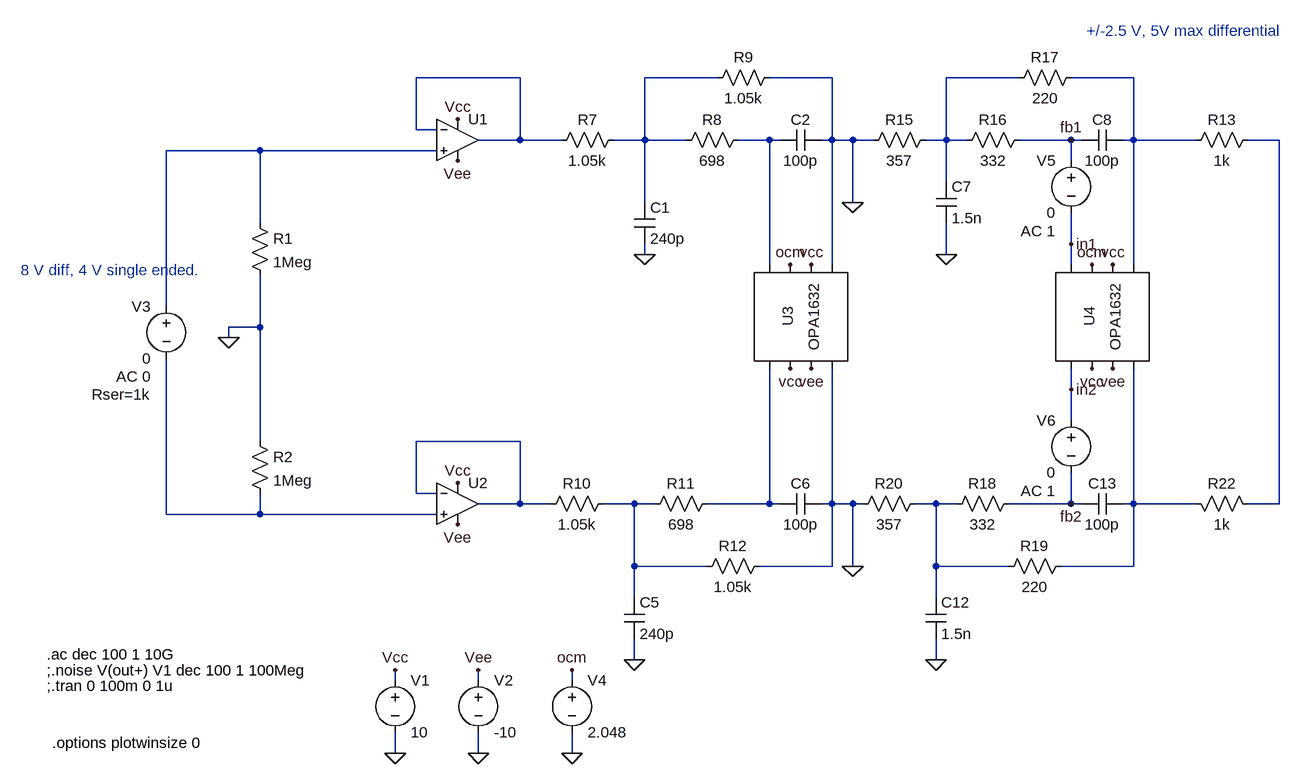
[diagram p0: schematic analog frontend stability.asc]
analog frontend stability.asc, the LTspice schematic file:
Version 4
SHEET 1 3264 948
WIRE 448 -112 288 -112
WIRE 752 -112 640 -112
WIRE 928 -112 832 -112
WIRE 1216 -112 1104 -112
WIRE 1392 -112 1296 -112
WIRE 288 -32 288 -112
WIRE 320 -32 288 -32
WIRE 448 -16 448 -112
WIRE 448 -16 384 -16
WIRE 512 -16 448 -16
WIRE 640 -16 640 -112
WIRE 640 -16 592 -16
WIRE 704 -16 640 -16
WIRE 832 -16 784 -16
WIRE 848 -16 832 -16
WIRE 928 -16 928 -112
WIRE 928 -16 912 -16
WIRE 960 -16 928 -16
WIRE 992 -16 960 -16
WIRE 1104 -16 1104 -112
WIRE 1104 -16 1072 -16
WIRE 1136 -16 1104 -16
WIRE 1296 -16 1216 -16
WIRE 1312 -16 1296 -16
WIRE 1392 -16 1392 -112
WIRE 1392 -16 1376 -16
WIRE 1488 -16 1392 -16
WIRE 1616 -16 1568 -16
WIRE 48 0 -96 0
WIRE 320 0 48 0
WIRE 1296 16 1296 -16
WIRE 1104 48 1104 -16
WIRE 640 80 640 -16
WIRE 960 80 960 -16
WIRE 48 112 48 0
WIRE 1296 144 1296 96
WIRE 640 160 640 144
WIRE 1104 160 1104 112
WIRE 832 176 832 -16
WIRE 928 176 928 -16
WIRE 1296 176 1296 144
WIRE 1392 176 1392 -16
WIRE -96 240 -96 0
WIRE 48 272 48 192
WIRE 48 272 0 272
WIRE 0 288 0 272
WIRE 1296 368 1296 336
WIRE 1296 416 1296 368
WIRE 48 448 48 272
WIRE 448 448 288 448
WIRE 288 528 288 448
WIRE 320 528 288 528
WIRE 448 544 448 448
WIRE 448 544 384 544
WIRE 496 544 448 544
WIRE 624 544 576 544
WIRE 656 544 624 544
WIRE 832 544 832 336
WIRE 832 544 736 544
WIRE 848 544 832 544
WIRE 928 544 928 336
WIRE 928 544 912 544
WIRE 960 544 928 544
WIRE 976 544 960 544
WIRE 1088 544 1056 544
WIRE 1120 544 1088 544
WIRE 1296 544 1296 496
WIRE 1296 544 1200 544
WIRE 1312 544 1296 544
WIRE 1392 544 1392 336
WIRE 1392 544 1376 544
WIRE 1488 544 1392 544
WIRE 1616 544 1616 -16
WIRE 1616 544 1568 544
WIRE -96 560 -96 320
WIRE 48 560 48 528
WIRE 48 560 -96 560
WIRE 320 560 48 560
WIRE 624 640 624 544
WIRE 736 640 624 640
WIRE 928 640 928 544
WIRE 928 640 816 640
WIRE 960 640 960 544
WIRE 1088 640 1088 544
WIRE 1200 640 1088 640
WIRE 1392 640 1392 544
WIRE 1392 640 1280 640
WIRE 624 688 624 640
WIRE 1088 688 1088 640
WIRE 624 784 624 752
WIRE 1088 784 1088 752
WIRE 256 816 256 800
WIRE 384 816 384 800
WIRE 528 816 528 800
WIRE 256 928 256 896
WIRE 384 928 384 896
WIRE 528 928 528 896
FLAG 256 928 0
FLAG 256 800 Vcc
FLAG 384 928 0
FLAG 384 800 Vee
FLAG 352 -48 Vcc
FLAG 352 16 Vee
FLAG 0 288 0
FLAG 352 512 Vcc
FLAG 352 576 Vee
FLAG 640 160 0
FLAG 624 784 0
FLAG 896 176 vcc
FLAG 896 336 vee
FLAG 1104 160 0
FLAG 1088 784 0
FLAG 1360 176 vcc
FLAG 1360 336 vee
FLAG 864 176 ocm
FLAG 528 800 ocm
FLAG 528 928 0
FLAG 864 336 vcc
FLAG 1328 176 ocm
FLAG 1328 336 vcc
FLAG 1296 368 in2
FLAG 1296 544 fb2
FLAG 1296 -16 fb1
FLAG 1296 144 in1
FLAG 960 80 0
FLAG 960 640 0
SYMBOL voltage 256 800 R0
WINDOW 123 0 0 Left 2
WINDOW 39 0 0 Left 2
SYMATTR InstName V1
SYMATTR Value 10
SYMBOL voltage 384 800 R0
WINDOW 123 0 0 Left 2
WINDOW 39 0 0 Left 2
SYMATTR InstName V2
SYMATTR Value -10
SYMBOL voltage -96 224 M0
WINDOW 123 24 124 Left 2
WINDOW 39 24 152 Left 2
SYMATTR Value2 AC 0
SYMATTR SpiceLine Rser=1k
SYMATTR InstName V3
SYMATTR Value 0
SYMBOL res 32 96 R0
SYMATTR InstName R1
SYMATTR Value 1Meg
SYMBOL res 32 432 R0
SYMATTR InstName R2
SYMATTR Value 1Meg
SYMBOL Opamps\\UniversalOpamp2 352 -16 R0
SYMATTR InstName U1
SYMATTR Value2 Avol=1Meg GBW=40Meg Slew=27Meg
SYMATTR SpiceLine2 en=1.1n enk=30 in=1.7p ink=50 Rin=500Meg
SYMBOL Opamps\\UniversalOpamp2 352 544 R0
SYMATTR InstName U2
SYMATTR Value2 Avol=1Meg GBW=40Meg Slew=27Meg
SYMATTR SpiceLine2 en=1.1n enk=30 in=1.7p ink=50 Rin=500Meg
SYMBOL res 608 -32 R90
WINDOW 0 0 56 VBottom 2
WINDOW 3 32 56 VTop 2
SYMATTR InstName R7
SYMATTR Value 1.05k
SYMBOL cap 624 80 R0
SYMATTR InstName C1
SYMATTR Value 240p
SYMBOL res 800 -32 R90
WINDOW 0 0 56 VBottom 2
WINDOW 3 32 56 VTop 2
SYMATTR InstName R8
SYMATTR Value 698
SYMBOL res 848 -128 R90
WINDOW 0 0 56 VBottom 2
WINDOW 3 32 56 VTop 2
SYMATTR InstName R9
SYMATTR Value 1.05k
SYMBOL cap 912 -32 R90
WINDOW 0 0 32 VBottom 2
WINDOW 3 32 32 VTop 2
SYMATTR InstName C2
SYMATTR Value 100p
SYMBOL res 592 528 R90
WINDOW 0 0 56 VBottom 2
WINDOW 3 32 56 VTop 2
SYMATTR InstName R10
SYMATTR Value 1.05k
SYMBOL cap 608 688 R0
SYMATTR InstName C5
SYMATTR Value 240p
SYMBOL res 752 528 R90
WINDOW 0 0 56 VBottom 2
WINDOW 3 32 56 VTop 2
SYMATTR InstName R11
SYMATTR Value 698
SYMBOL cap 912 528 R90
WINDOW 0 0 32 VBottom 2
WINDOW 3 32 32 VTop 2
SYMATTR InstName C6
SYMATTR Value 100p
SYMBOL res 832 624 R90
WINDOW 0 0 56 VBottom 2
WINDOW 3 32 56 VTop 2
SYMATTR InstName R12
SYMATTR Value 1.05k
SYMBOL res 1088 -32 R90
WINDOW 0 0 56 VBottom 2
WINDOW 3 32 56 VTop 2
SYMATTR InstName R15
SYMATTR Value 357
SYMBOL cap 1088 48 R0
SYMATTR InstName C7
SYMATTR Value 1.5n
SYMBOL res 1232 -32 R90
WINDOW 0 0 56 VBottom 2
WINDOW 3 32 56 VTop 2
SYMATTR InstName R16
SYMATTR Value 332
SYMBOL res 1312 -128 R90
WINDOW 0 0 56 VBottom 2
WINDOW 3 32 56 VTop 2
SYMATTR InstName R17
SYMATTR Value 220
SYMBOL cap 1376 -32 R90
WINDOW 0 0 32 VBottom 2
WINDOW 3 32 32 VTop 2
SYMATTR InstName C8
SYMATTR Value 100p
SYMBOL cap 1072 688 R0
SYMATTR InstName C12
SYMATTR Value 1.5n
SYMBOL res 1216 528 R90
WINDOW 0 0 56 VBottom 2
WINDOW 3 32 56 VTop 2
SYMATTR InstName R18
SYMATTR Value 332
SYMBOL cap 1376 528 R90
WINDOW 0 0 32 VBottom 2
WINDOW 3 32 32 VTop 2
SYMATTR InstName C13
SYMATTR Value 100p
SYMBOL res 1296 624 R90
WINDOW 0 0 56 VBottom 2
WINDOW 3 32 56 VTop 2
SYMATTR InstName R19
SYMATTR Value 220
SYMBOL res 1072 528 R90
WINDOW 0 0 56 VBottom 2
WINDOW 3 32 56 VTop 2
SYMATTR InstName R20
SYMATTR Value 357
SYMBOL res 1584 -32 R90
WINDOW 0 0 56 VBottom 2
WINDOW 3 32 56 VTop 2
SYMATTR InstName R13
SYMATTR Value 1k
SYMBOL res 1584 560 M270
WINDOW 0 32 56 VTop 2
WINDOW 3 0 56 VBottom 2
SYMATTR InstName R22
SYMATTR Value 1k
SYMBOL voltage 528 800 R0
WINDOW 123 0 0 Left 2
WINDOW 39 0 0 Left 2
SYMATTR InstName V4
SYMATTR Value 2.048
SYMBOL AutoGenerated\\OPA1632 880 256 M90
SYMATTR InstName U3
SYMBOL AutoGenerated\\OPA1632 1344 256 M90
SYMATTR InstName U4
SYMBOL voltage 1296 0 M0
WINDOW 123 24 124 Left 2
WINDOW 39 0 0 Left 2
SYMATTR Value2 AC 1
SYMATTR InstName V5
SYMATTR Value 0
SYMBOL voltage 1296 400 M0
WINDOW 123 24 124 Left 2
WINDOW 39 0 0 Left 2
SYMATTR Value2 AC 1
SYMATTR InstName V6
SYMATTR Value 0
TEXT -280 776 Left 2 !.ac dec 100 1 10G
TEXT -280 800 Left 2 !;.noise V(out+) V1 dec 100 1 100Meg
TEXT -280 824 Left 2 !;.tran 0 100m 0 1u
TEXT -272 912 Left 2 !.options plotwinsize 0
TEXT -320 184 Left 2 ;8 V diff, 4 V single ended.
TEXT 1320 -184 Left 2 ;+/-2.5 V, 5V max differential

The netlist it stands for:
* analog frontend stability.asc
V1 Vcc 0 10
V2 Vee 0 -10
V3 N007 N013 0 AC 0 Rser=1k
R1 N007 0 1Meg
R2 0 N013 1Meg
XU1 N007 N001 Vcc Vee N001 level.2 Avol=1Meg GBW=40Meg Slew=27Meg ilimit=25m rail=0 Vos=0 phimargin=45 en=1.1n enk=30 in=1.7p ink=50 Rin=500Meg  ; pins IN+ IN- V+ V- OUT
XU2 N013 N008 Vcc Vee N008 level.2 Avol=1Meg GBW=40Meg Slew=27Meg ilimit=25m rail=0 Vos=0 phimargin=45 en=1.1n enk=30 in=1.7p ink=50 Rin=500Meg  ; pins IN+ IN- V+ V- OUT
R7 N002 N001 1.05k
C1 N002 0 240p
R8 N005 N002 698
R9 0 N002 1.05k
C2 0 N005 100p
R10 N009 N008 1.05k
C5 N009 0 240p
R11 N010 N009 698
C6 0 N010 100p
R12 0 N009 1.05k
R15 N003 0 357
C7 N003 0 1.5n
R16 fb1 N003 332
R17 N004 N003 220
C8 N004 fb1 100p
C12 N011 0 1.5n
R18 fb2 N011 332
C13 N012 fb2 100p
R19 N012 N011 220
R20 N011 0 357
R13 N006 N004 1k
R22 N006 N012 1k
V4 ocm 0 2.048
* U3: OPA1632 (symbol AutoGenerated\OPA1632 not available, pins judged from their places): pin1=N005 pin2=ocm pin3=Vcc pin4=0 pin5=N010 pin6=Vcc pin7=Vee pin8=0
* U4: OPA1632 (symbol AutoGenerated\OPA1632 not available, pins judged from their places): pin1=in1 pin2=ocm pin3=Vcc pin4=N004 pin5=in2 pin6=Vcc pin7=Vee pin8=N012
V5 fb1 in1 0 AC 1
V6 in2 fb2 0 AC 1
.ac dec 100 1 10G
;.noise V(out+) V1 dec 100 1 100Meg
;.tran 0 100m 0 1u
.options plotwinsize 0
* 8 V diff, 4 V single ended.
* +/-2.5 V, 5V max differential
.lib UniversalOpamps2.sub
.backanno
.end